# EAGLE schematic tardis-r1-2019-07-03 (EAGLE 9.4.2)

## Sheet 1 of 2
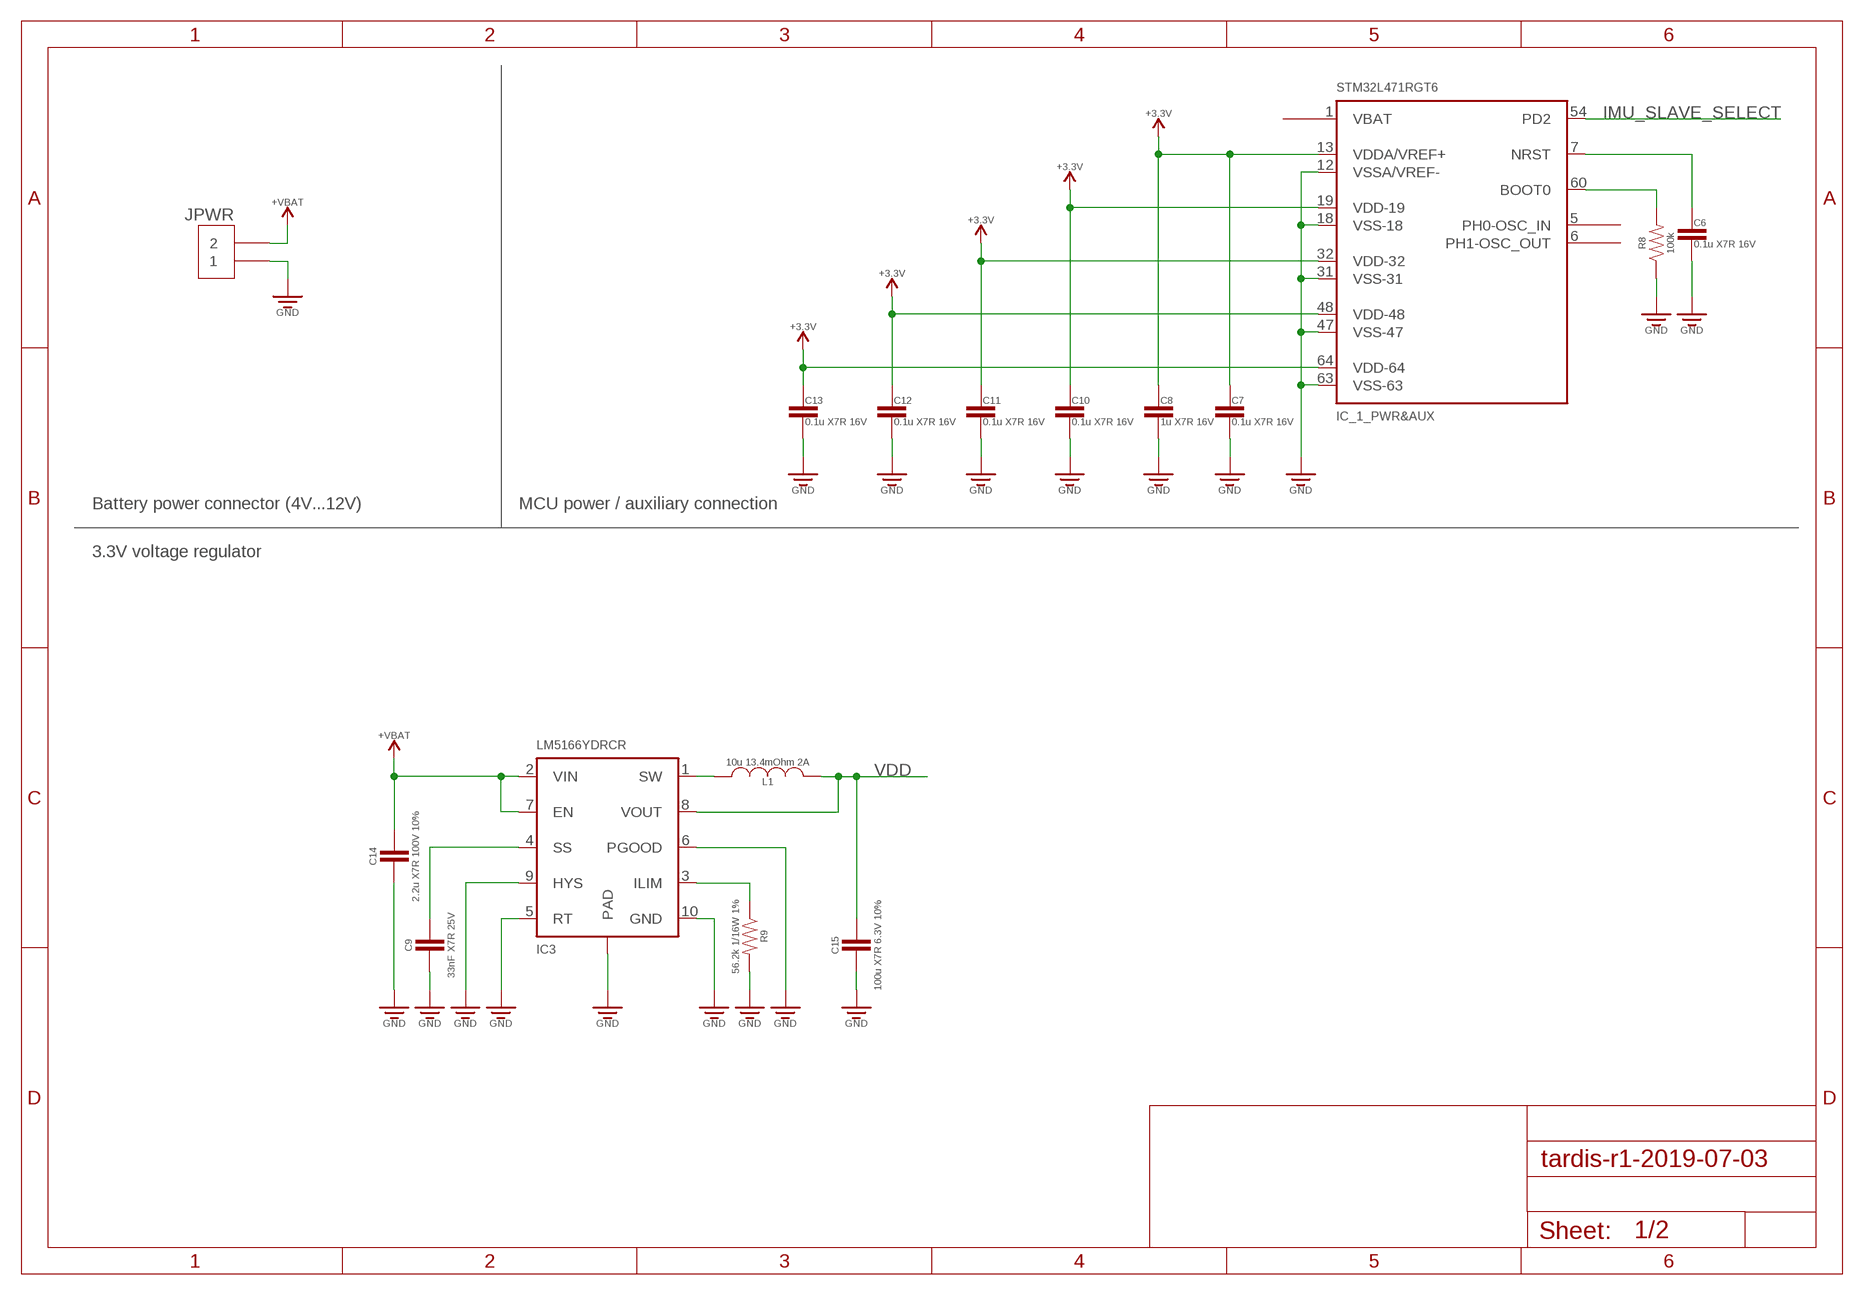
[diagram p0: schematic, sheet 1]

### Parts
C6  0.1u X7R 16V  CAPACITOR0603  [CAPACITOR-0603]
C7  0.1u X7R 16V  CAPACITOR0603  [CAPACITOR-0603]
C8  1u X7R 16V  CAPACITOR0603  [CAPACITOR-0603]
C9  33nF X7R 25V  CAPACITOR0402  [CAPACITOR-0402]
C10  0.1u X7R 16V  CAPACITOR0603  [CAPACITOR-0603]
C11  0.1u X7R 16V  CAPACITOR0603  [CAPACITOR-0603]
C12  0.1u X7R 16V  CAPACITOR0603  [CAPACITOR-0603]
C13  0.1u X7R 16V  CAPACITOR0603  [CAPACITOR-0603]
C14  2.2u X7R 100V 10%  CAPACITOR1206  [CAPACITOR-1206]
C15  100u X7R 6.3V 10%  CAPACITOR1206  [CAPACITOR-1206]
IC3  LM5166YDRCR  [VSON-10-0.5MM-PAD]
IC_1  STM32L471RGT6  [LQFP64_10X10]
JPWR  WURTH_691103110002  [WURTH_691103110002]
L1  10u 13.4mOhm 2A  INDUCTORWE-74477710  [INDUCTOR-WE-74477710]
R8  100k  RESISTOR0603  [RESISTOR-0603]
R9  56.2k 1/16W 1%  RESISTOR0402  [RESISTOR-0402]
SUPPLY9  +VBAT  (no package)
SUPPLY10  +3.3V  (no package)
SUPPLY11  +3.3V  (no package)
SUPPLY12  +3.3V  (no package)
SUPPLY13  +3.3V  (no package)
SUPPLY14  +3.3V  (no package)
SUPPLY15  +VBAT  (no package)
U$3  NC  (no package)
U$4  NC  (no package)
U$5  NC  (no package)

### Nets
BOOT0: IC_1.60(_PWR&AUX:BOOT0) R8.P$2
GND: C6.2 C7.2 C8.2 C9.P$2 C10.2 C11.2 C12.2 C13.2 C14.P$2 C15.P$2 IC3.5(RT) IC3.6(PGOOD) IC3.9(HYS) IC3.10(GND) IC3.PAD IC_1.12(_PWR&AUX:VSSA/VREF-) IC_1.18(_PWR&AUX:VSS-18) IC_1.31(_PWR&AUX:VSS-31) IC_1.47(_PWR&AUX:VSS-47) IC_1.63(_PWR&AUX:VSS-63) JPWR.1 R8.P$1 R9.P$2 ; also sheet 2
ILIM: IC3.3(ILIM) R9.P$1
IMU_SLAVE_SELECT: IC_1.54(_PWR&AUX:PD2) ; also sheet 2
NRST: C6.1 IC_1.7(_PWR&AUX:NRST)
SS: C9.P$1 IC3.4(SS)
SW: IC3.1(SW) L1.P$1
VBAT: C14.P$1 IC3.2(VIN) IC3.7(EN) JPWR.2 SUPPLY9.VCC SUPPLY15.VCC
VDD: C7.1 C8.1 C10.1 C11.1 C12.1 C13.1 C15.P$1 IC3.8(VOUT) IC_1.13(_PWR&AUX:VDDA/VREF+) IC_1.19(_PWR&AUX:VDD-19) IC_1.32(_PWR&AUX:VDD-32) IC_1.48(_PWR&AUX:VDD-48) IC_1.64(_PWR&AUX:VDD-64) L1.P$2 SUPPLY10.VCC SUPPLY11.VCC SUPPLY12.VCC SUPPLY13.VCC SUPPLY14.VCC ; also sheet 2
Unconnected: IC_1.1(_PWR&AUX:VBAT) IC_1.5(_PWR&AUX:PH0-OSC_IN) IC_1.6(_PWR&AUX:PH1-OSC_OUT) U$3.1 U$4.1 U$5.1

### Notes on the sheet
- Battery power connector (4V...12V) | MCU power / auxiliary connection
- 3.3V voltage regulator

## Sheet 2 of 2
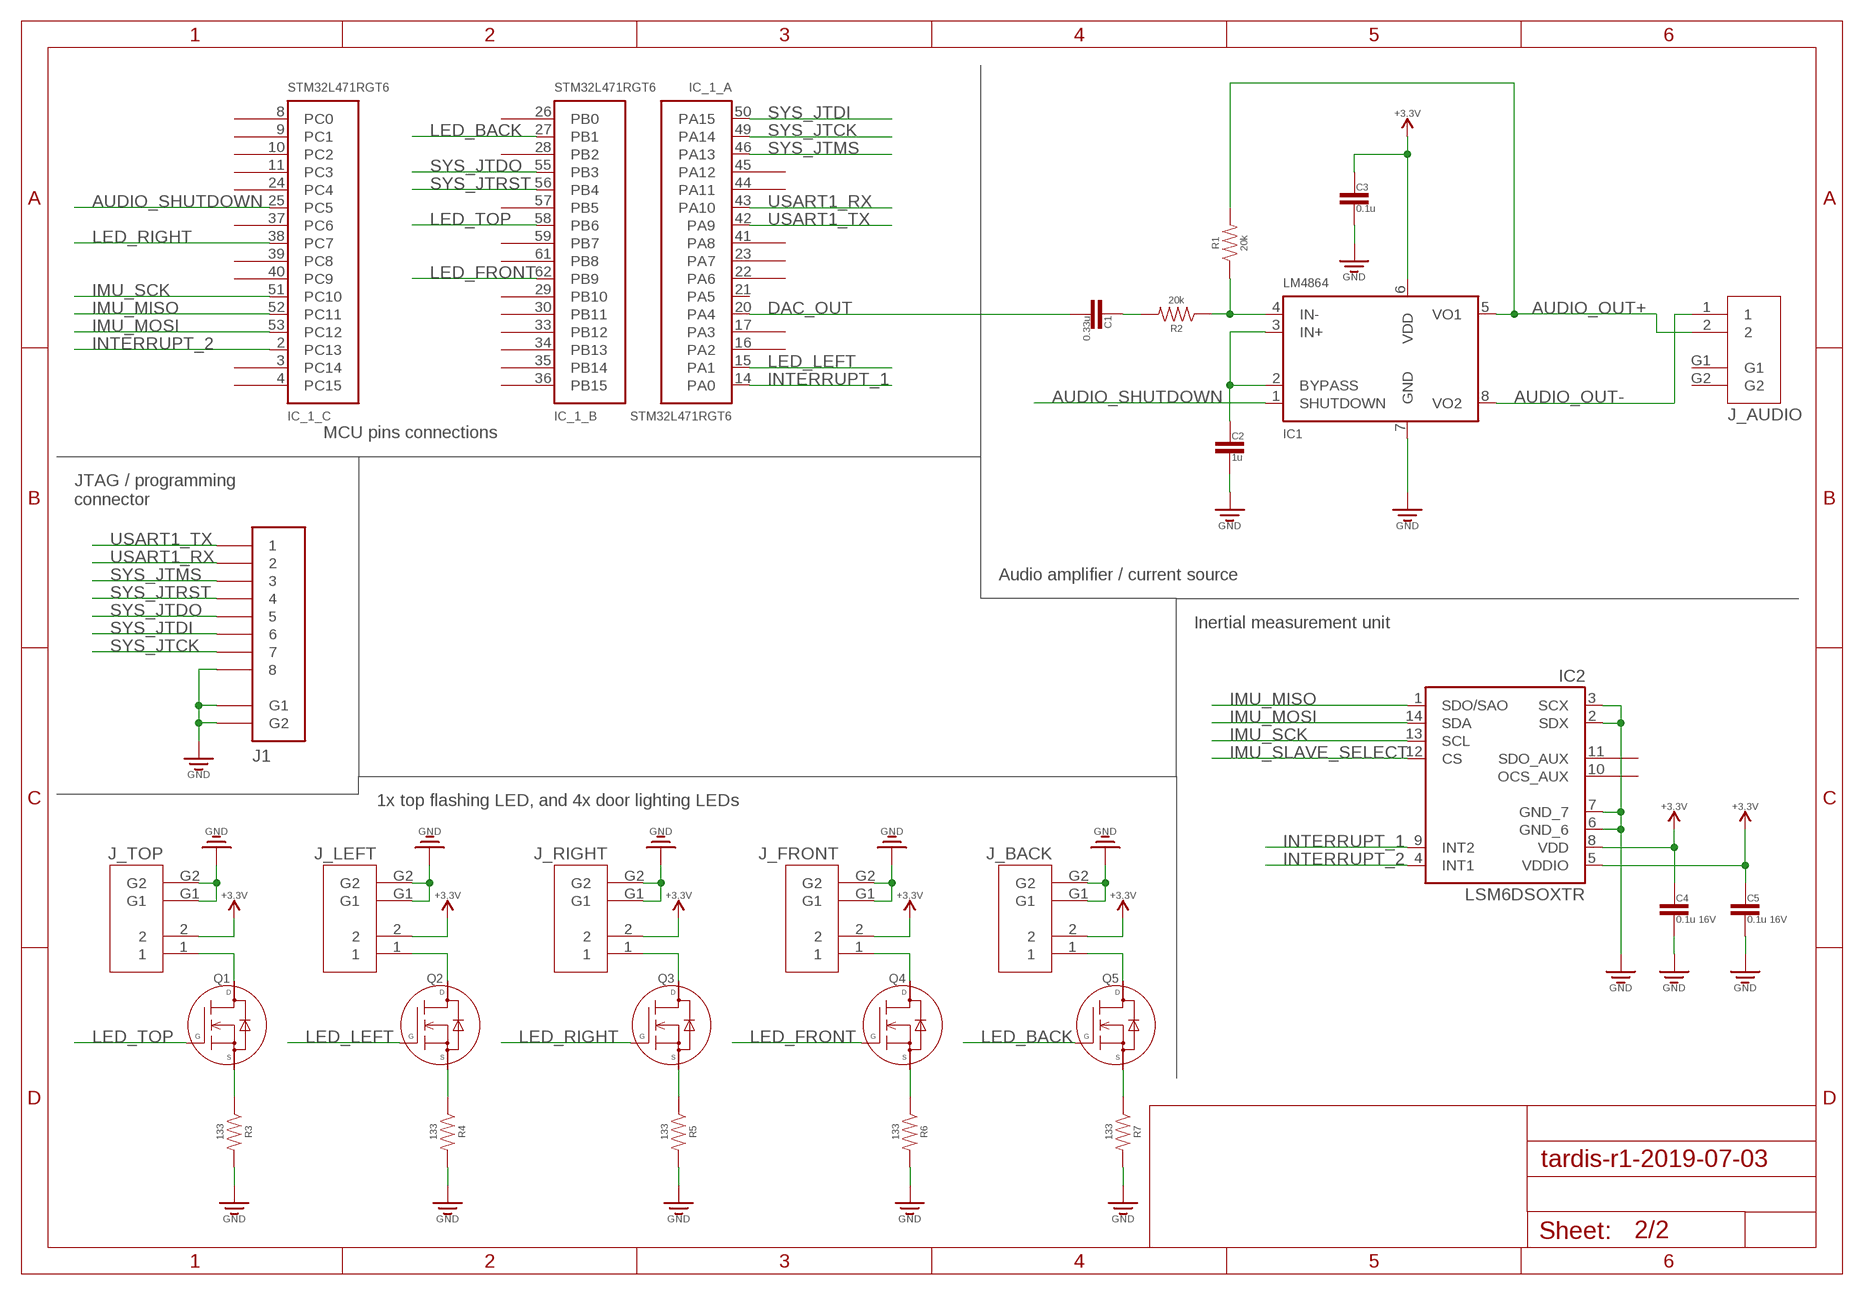
[diagram p1: schematic, sheet 2]

### Parts
C1  0.33u  CAPACITOR0805  [CAPACITOR-0805]
C2  1u  CAPACITOR0805  [CAPACITOR-0805]
C3  0.1u  CAPACITOR0805  [CAPACITOR-0805]
C4  0.1u 16V  CAPACITOR0603  [CAPACITOR-0603]
C5  0.1u 16V  CAPACITOR0603  [CAPACITOR-0603]
IC1  LM4864  [SOIC-8]
IC2  LSM6DSOXTR  [LGA-14L]
J1  MOLEX-53261-0871  [MOLEX-53261-0871]
J_AUDIO  MOLEX-502382-02XX  [MOLEX-502382-02XX]
J_BACK  MOLEX-502382-02XX  [MOLEX-502382-02XX]
J_FRONT  MOLEX-502382-02XX  [MOLEX-502382-02XX]
J_LEFT  MOLEX-502382-02XX  [MOLEX-502382-02XX]
J_RIGHT  MOLEX-502382-02XX  [MOLEX-502382-02XX]
J_TOP  MOLEX-502382-02XX  [MOLEX-502382-02XX]
Q1  2N7002  [SOT-23]
Q2  2N7002  [SOT-23]
Q3  2N7002  [SOT-23]
Q4  2N7002  [SOT-23]
Q5  2N7002  [SOT-23]
R1  20k  RESISTOR0805  [RESISTOR-0805]
R2  20k  RESISTOR0805  [RESISTOR-0805]
R3  133  RESISTOR0805  [RESISTOR-0805]
R4  133  RESISTOR0805  [RESISTOR-0805]
R5  133  RESISTOR0805  [RESISTOR-0805]
R6  133  RESISTOR0805  [RESISTOR-0805]
R7  133  RESISTOR0805  [RESISTOR-0805]
SUPPLY1  +3.3V  (no package)
SUPPLY2  +3.3V  (no package)
SUPPLY3  +3.3V  (no package)
SUPPLY4  +3.3V  (no package)
SUPPLY5  +3.3V  (no package)
SUPPLY6  +3.3V  (no package)
SUPPLY7  +3.3V  (no package)
SUPPLY8  +3.3V  (no package)
U$1  NC  (no package)
U$2  NC  (no package)
U$6  NC  (no package)
U$7  NC  (no package)
U$8  NC  (no package)
U$9  NC  (no package)
U$10  NC  (no package)
U$11  NC  (no package)
U$12  NC  (no package)
U$13  NC  (no package)
U$14  NC  (no package)
U$15  NC  (no package)
U$16  NC  (no package)
U$17  NC  (no package)
U$18  NC  (no package)
U$19  NC  (no package)
U$20  NC  (no package)
U$21  NC  (no package)
U$22  NC  (no package)
U$23  NC  (no package)
U$24  NC  (no package)
U$25  NC  (no package)
U$26  NC  (no package)
U$27  NC  (no package)
U$28  NC  (no package)
U$30  NC  (no package)
U$31  NC  (no package)
U$32  NC  (no package)
U$33  NC  (no package)
U$34  NC  (no package)

### Nets
AUDIO_OUT+: IC1.5(VO1) J_AUDIO.2 R1.2
AUDIO_OUT-: IC1.8(VO2) J_AUDIO.1
AUDIO_SHUTDOWN: IC1.1(SHUTDOWN) IC_1.25(_C:PC5)
DAC_OUT: C1.2 IC_1.20(_A:PA4)
GND: C2.2 C3.2 C4.2 C5.2 IC1.7(GND) IC2.2(SDX) IC2.3(SCX) IC2.6(GND_6) IC2.7(GND_7) J1.8 J1.G1 J1.G2 J_BACK.G1 J_BACK.G2 J_FRONT.G1 J_FRONT.G2 J_LEFT.G1 J_LEFT.G2 J_RIGHT.G1 J_RIGHT.G2 J_TOP.G1 J_TOP.G2 R3.2 R4.2 R5.2 R6.2 R7.2 ; also sheet 1
IMU_MISO: IC2.1(SDO/SAO) IC_1.52(_C:PC11)
IMU_MOSI: IC2.14(SDA) IC_1.53(_C:PC12)
IMU_SCK: IC2.13(SCL) IC_1.51(_C:PC10)
IMU_SLAVE_SELECT: IC2.12(CS) ; also sheet 1
INTERRUPT_1: IC2.9(INT2) IC_1.14(_A:PA0)
INTERRUPT_2: IC2.4(INT1) IC_1.2(_C:PC13)
LED_BACK: IC_1.27(_B:PB1) Q5.P$2(GATE)
LED_FRONT: IC_1.62(_B:PB9) Q4.P$2(GATE)
LED_LEFT: IC_1.15(_A:PA1) Q2.P$2(GATE)
LED_RIGHT: IC_1.38(_C:PC7) Q3.P$2(GATE)
LED_TOP: IC_1.58(_B:PB6) Q1.P$2(GATE)
N$2: C2.1 IC1.2(BYPASS) IC1.3(IN+)
N$3: Q1.P$3(SOURCE) R3.1
N$4: IC1.4(IN-) R1.1 R2.1
N$5: C1.1 R2.2
N$6: J_TOP.1 Q1.P$1(DRAIN)
N$7: Q2.P$3(SOURCE) R4.1
N$8: J_LEFT.1 Q2.P$1(DRAIN)
N$10: Q3.P$3(SOURCE) R5.1
N$11: J_RIGHT.1 Q3.P$1(DRAIN)
N$13: Q4.P$3(SOURCE) R6.1
N$14: J_FRONT.1 Q4.P$1(DRAIN)
N$16: Q5.P$3(SOURCE) R7.1
N$17: J_BACK.1 Q5.P$1(DRAIN)
SYS_JTCK: IC_1.49(_A:PA14) J1.7
SYS_JTDI: IC_1.50(_A:PA15) J1.6
SYS_JTDO: IC_1.55(_B:PB3) J1.5
SYS_JTMS: IC_1.46(_A:PA13) J1.3
SYS_JTRST: IC_1.56(_B:PB4) J1.4
USART1_RX: IC_1.43(_A:PA10) J1.2
USART1_TX: IC_1.42(_A:PA9) J1.1
VDD: C3.1 C4.1 C5.1 IC1.6(VDD) IC2.5(VDDIO) IC2.8(VDD) J_BACK.2 J_FRONT.2 J_LEFT.2 J_RIGHT.2 J_TOP.2 SUPPLY1.VCC SUPPLY2.VCC SUPPLY3.VCC SUPPLY4.VCC SUPPLY5.VCC SUPPLY6.VCC SUPPLY7.VCC SUPPLY8.VCC ; also sheet 1
Unconnected: IC2.10(OCS_AUX) IC2.11(SDO_AUX) IC_1.3(_C:PC14) IC_1.4(_C:PC15) IC_1.8(_C:PC0) IC_1.9(_C:PC1) IC_1.10(_C:PC2) IC_1.11(_C:PC3) IC_1.16(_A:PA2) IC_1.17(_A:PA3) IC_1.21(_A:PA5) IC_1.22(_A:PA6) IC_1.23(_A:PA7) IC_1.24(_C:PC4) IC_1.26(_B:PB0) IC_1.28(_B:PB2) IC_1.29(_B:PB10) IC_1.30(_B:PB11) IC_1.33(_B:PB12) IC_1.34(_B:PB13) IC_1.35(_B:PB14) IC_1.36(_B:PB15) IC_1.37(_C:PC6) IC_1.39(_C:PC8) IC_1.40(_C:PC9) IC_1.41(_A:PA8) IC_1.44(_A:PA11) IC_1.45(_A:PA12) IC_1.57(_B:PB5) IC_1.59(_B:PB7) IC_1.61(_B:PB8) J_AUDIO.G1 J_AUDIO.G2 U$1.1 U$2.1 U$6.1 U$7.1 U$8.1 U$9.1 U$10.1 U$11.1 U$12.1 U$13.1 U$14.1 U$15.1 U$16.1 U$17.1 U$18.1 U$19.1 U$20.1 U$21.1 U$22.1 U$23.1 U$24.1 U$25.1 U$26.1 U$27.1 U$28.1 U$30.1 U$31.1 U$32.1 U$33.1 U$34.1

### Notes on the sheet
- MCU pins connections
- JTAG / programming
  connector
- Audio amplifier / current source
- Inertial measurement unit
- 1x top flashing LED, and 4x door lighting LEDs

## Library data of the parts
C1-C15 = passives:CAPACITOR
IC1 = amp:LM4864
IC2 = sensors:LSM6DSOXTR
IC3 = voltage-regulator:LM5166YDRCR
IC_1 = mcu:STM32L471RGT6
J1 = connectors:MOLEX-53261-0871
J_AUDIO J_BACK J_FRONT J_LEFT J_RIGHT J_TOP = connectors:MOLEX-502382-02XX
JPWR = connectors:WURTH_691103110002
L1 = passives:INDUCTOR
Q1-Q5 = passives:2N7002
R1-R9 = passives:RESISTOR
SUPPLY1-SUPPLY8 SUPPLY10-SUPPLY14 = voltage-ground:+3.3V: +3.3V Voltage Supply Positive voltage supply (traditionally for a BJT device, C=collector).
SUPPLY9 SUPPLY15 = voltage-ground:+VBAT: +3.3V Voltage Supply Positive voltage supply (traditionally for a BJT device, C=collector).
U$1-U$28 U$30-U$34 = voltage-ground:NC